# EAGLE schematic boneclamp_rB (EAGLE 6.4)

## Sheet 1 of 6: Beaglebone interface
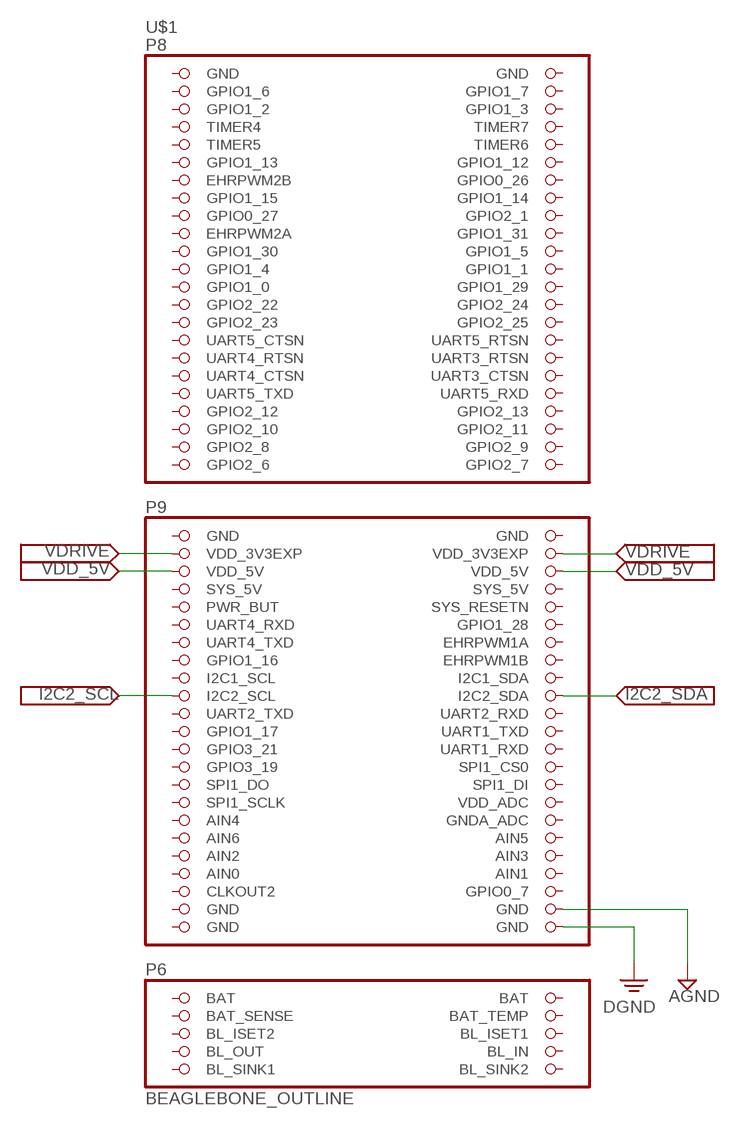
[diagram p0: schematic, sheet 1]

### Parts
U$1  BEAGLEBONE_OUTLINE  [BEAGLEBONE_SHIELD]

### Nets
AGND: U$1.90(GND) ; also sheet 2,3,5,6
DGND: U$1.92(GND) ; also sheet 4,5
I2C2_SCL: U$1.65(I2C2_SCL) ; also sheet 4
I2C2_SDA: U$1.66(I2C2_SDA) ; also sheet 4
VDD_5V: U$1.51(VDD_5V) U$1.52(VDD_5V) ; also sheet 5
VDRIVE: U$1.49(VDD_3V3EXP) U$1.50(VDD_3V3EXP) ; also sheet 2,3,4
Unconnected: U$1.3(GPIO1_6) U$1.4(GPIO1_7) U$1.5(GPIO1_2) U$1.6(GPIO1_3) U$1.7(TIMER4) U$1.8(TIMER7) U$1.9(TIMER5) U$1.10(TIMER6) U$1.11(GPIO1_13) U$1.12(GPIO1_12) U$1.13(EHRPWM2B) U$1.14(GPIO0_26) U$1.15(GPIO1_15) U$1.16(GPIO1_14) U$1.17(GPIO0_27) U$1.18(GPIO2_1) U$1.19(EHRPWM2A) U$1.20(GPIO1_31) U$1.21(GPIO1_30) U$1.22(GPIO1_5) U$1.23(GPIO1_4) U$1.24(GPIO1_1) U$1.25(GPIO1_0) U$1.26(GPIO1_29) U$1.27(GPIO2_22) U$1.28(GPIO2_24) U$1.29(GPIO2_23) U$1.30(GPIO2_25) U$1.31(UART5_CTSN) U$1.32(UART5_RTSN) U$1.33(UART4_RTSN) U$1.34(UART3_RTSN) U$1.35(UART4_CTSN) U$1.36(UART3_CTSN) U$1.37(UART5_TXD) U$1.38(UART5_RXD) U$1.39(GPIO2_12) U$1.40(GPIO2_13) U$1.41(GPIO2_10) U$1.42(GPIO2_11) U$1.43(GPIO2_8) U$1.44(GPIO2_9) U$1.45(GPIO2_6) U$1.46(GPIO2_7) U$1.54(SYS_5V) U$1.55(PWR_BUT) U$1.56(SYS_RESETN) U$1.57(UART4_RXD) U$1.58(GPIO1_28) U$1.59(UART4_TXD) U$1.60(EHRPWM1A) U$1.61(GPIO1_16) U$1.62(EHRPWM1B) U$1.63(I2C1_SCL) U$1.64(I2C1_SDA) U$1.67(UART2_TXD) U$1.68(UART2_RXD) U$1.69(GPIO1_17) U$1.70(UART1_TXD) U$1.71(GPIO3_21) U$1.72(UART1_RXD) U$1.73(GPIO3_19) U$1.74(SPI1_CS0) U$1.75(SPI1_DO) U$1.76(SPI1_DI) U$1.77(SPI1_SCLK) U$1.78(VDD_ADC) U$1.79(AIN4) U$1.80(GNDA_ADC) U$1.81(AIN6) U$1.82(AIN5) U$1.83(AIN2) U$1.84(AIN3) U$1.86(AIN1) U$1.87(CLKOUT2) U$1.88(GPIO0_7) U$1.93(BAT) U$1.94(BAT) U$1.96(BAT_TEMP) U$1.98(BL_ISET1) U$1.99(BL_ISET2)

## Sheet 2 of 6: ADC
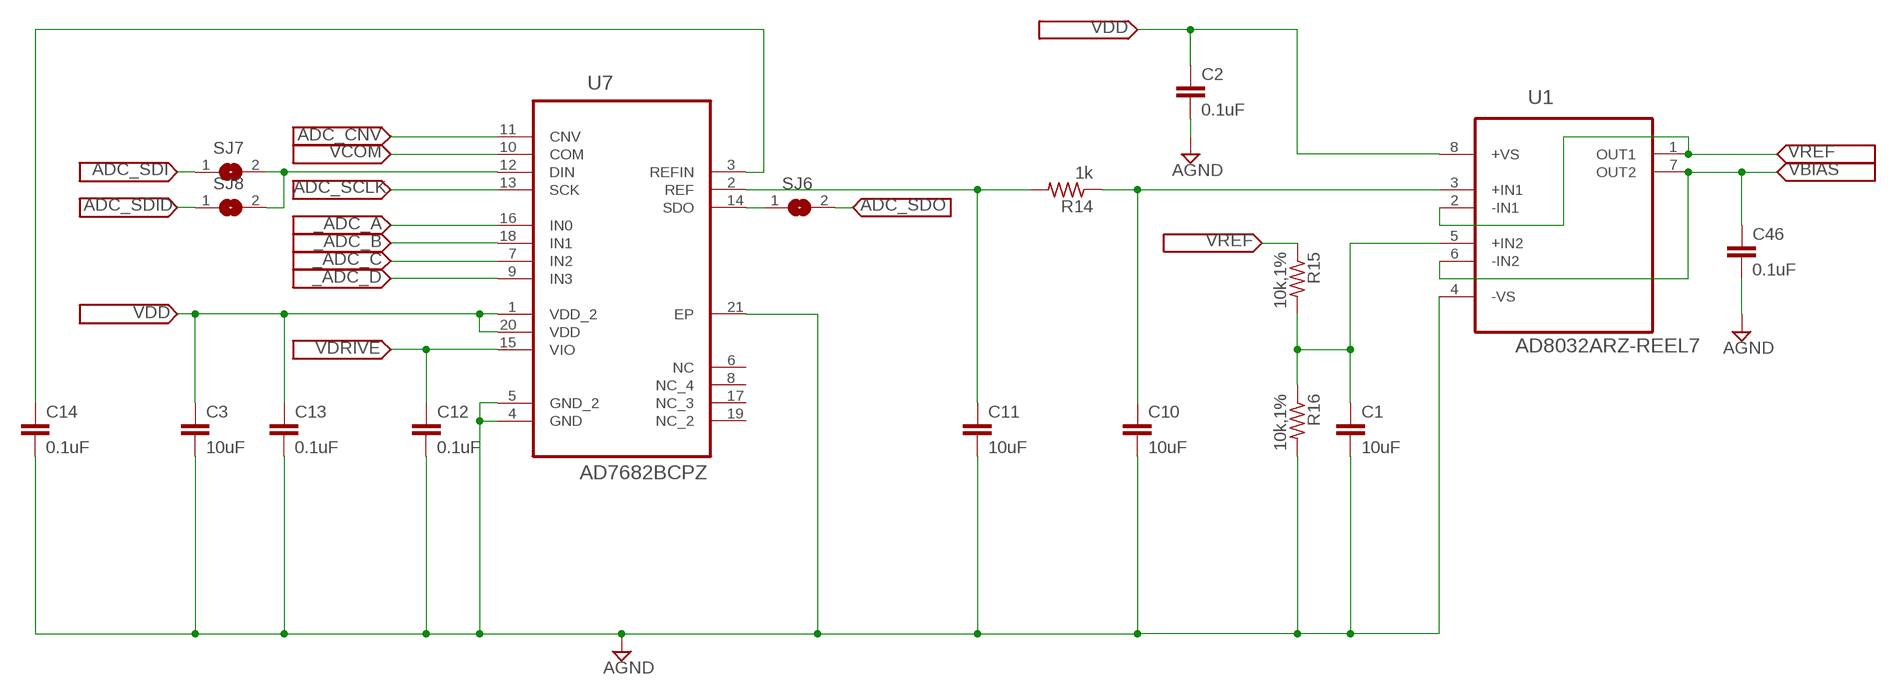
[diagram p1: schematic, sheet 2]

### Parts
C1  10uF  C-EUC0805  [C0805]
C2  0.1uF  C-EUC0805  [C0805]
C3  10uF  C-EUC0805  [C0805]
C10  10uF  C-EUC0805  [C0805]
C11  10uF  C-EUC0805  [C0805]
C12  0.1uF  C-EUC0805  [C0805]
C13  0.1uF  C-EUC0805  [C0805]
C14  0.1uF  C-EUC0805  [C0805]
C46  0.1uF  C-EUC0805  [C0805]
R14  1k  R-US_R0805  [R0805]
R15  10k,1%  R-US_R0805  [R0805]
R16  10k,1%  R-US_R0805  [R0805]
SJ6  SJ  [SJ]
SJ7  SJ  [SJ]
SJ8  SJ  [SJ]
U1  AD8032ARZ-REEL7  [SOIC127P600X175-8N]
U7  AD7682BCPZ  [QFN50P400X400X100-21N]

### Nets
_ADC_A: U7.16(IN0) ; also sheet 6
_ADC_B: U7.18(IN1) ; also sheet 6
_ADC_C: U7.7(IN2) ; also sheet 6
_ADC_D: U7.9(IN3) ; also sheet 6
ADC_CNV: U7.11(CNV)
ADC_SCLK: U7.13(SCK)
ADC_SDI: SJ7.1
ADC_SDID: SJ8.1
ADC_SDO: SJ6.2
AGND: C1.2 C2.2 C3.2 C10.2 C11.2 C12.2 C13.2 C14.2 C46.2 R16.2 U1.4(-VS) U7.4(GND) U7.5(GND_2) U7.21(EP) ; also sheet 1,3,5,6
N$4: C1.1 R15.2 R16.1 U1.5(+IN2)
N$9: SJ6.1
N$11: SJ7.2 SJ8.2 U7.12(DIN)
N$28: C11.1 R14.2 U7.2(REF)
N$29: C10.1 R14.1 U1.3(+IN1)
N$34: C14.1 U7.3(REFIN)
VBIAS: C46.1 U1.6(-IN2) U1.7(OUT2) ; also sheet 6
VCOM: U7.10(COM)
VDD: C2.1 C3.1 C13.1 U1.8(+VS) U7.1(VDD_2) U7.20(VDD) ; also sheet 3,5,6
VDRIVE: C12.1 U7.15(VIO) ; also sheet 1,3,4
VREF: R15.1 U1.1(OUT1) U1.2(-IN1) ; also sheet 3
Unconnected: U7.6(NC) U7.8(NC_4) U7.14(SDO) U7.17(NC_3) U7.19(NC_2)

## Sheet 3 of 6: DAC
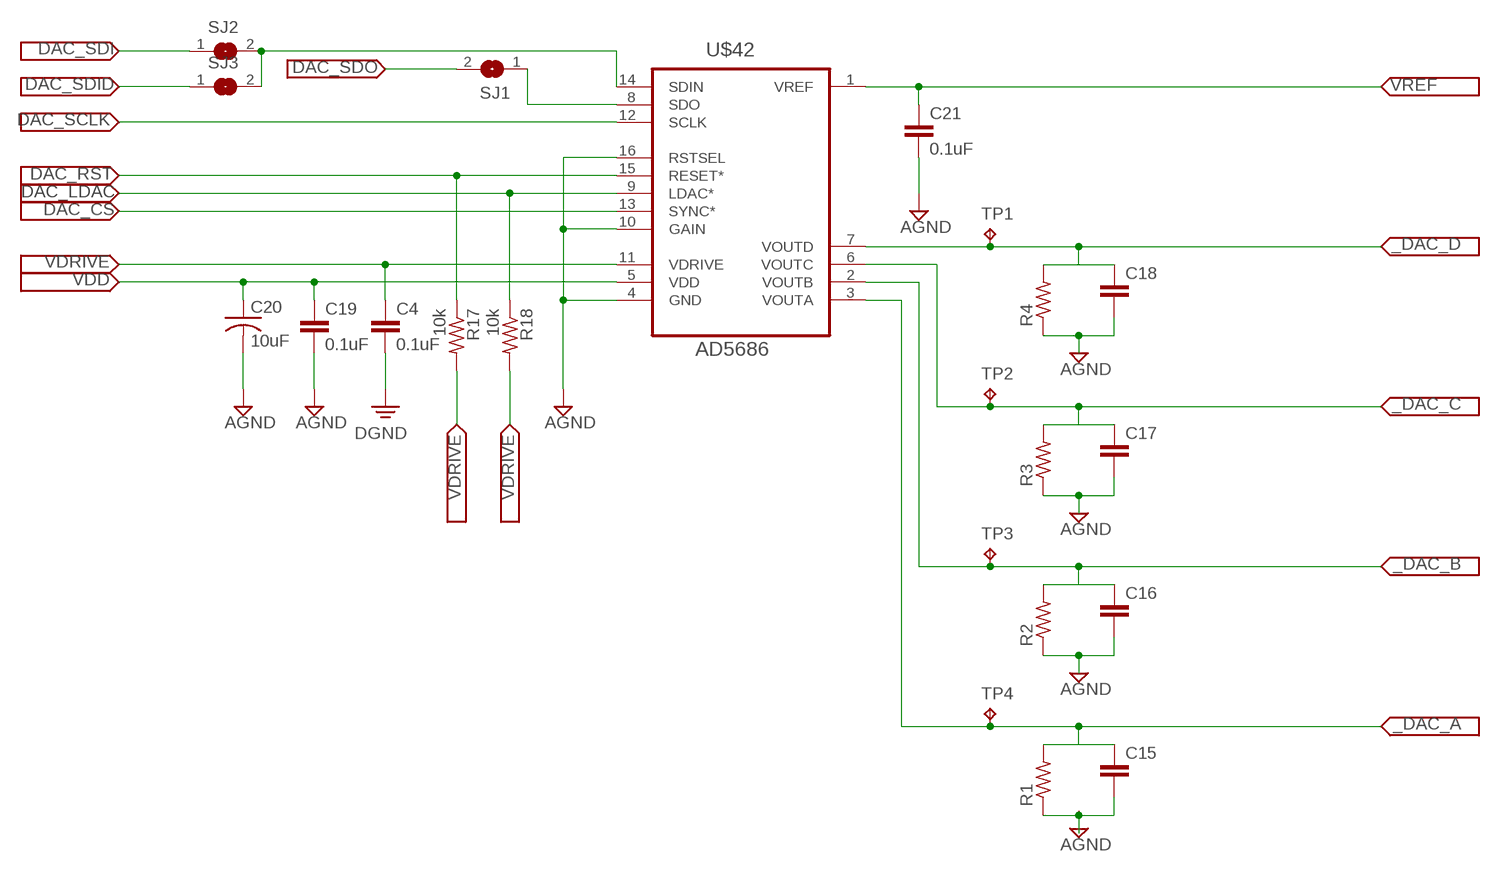
[diagram p2: schematic, sheet 3]

### Parts
C4  0.1uF  C-EUC0805  [C0805]
C15  C-EUC0805  [C0805]
C16  C-EUC0805  [C0805]
C17  C-EUC0805  [C0805]
C18  C-EUC0805  [C0805]
C19  0.1uF  C-EUC0805  [C0805]
C20  10uF  C-USC0805  [C0805]
C21  0.1uF  C-EUC0805  [C0805]
R1  R-US_R0805  [R0805]
R2  R-US_R0805  [R0805]
R3  R-US_R0805  [R0805]
R4  R-US_R0805  [R0805]
R17  10k  R-US_R0805  [R0805]
R18  10k  R-US_R0805  [R0805]
SJ1  SJ  [SJ]
SJ2  SJ  [SJ]
SJ3  SJ  [SJ]
TP1  TPB1,27  [B1,27]
TP2  TPB1,27  [B1,27]
TP3  TPB1,27  [B1,27]
TP4  TPB1,27  [B1,27]
U$42  AD5686  AD5686RARUZ  [MO-153-AB]

### Nets
_DAC_A: C15.1 R1.2 TP4.TP U$42.3(VOUTA) ; also sheet 6
_DAC_B: C16.1 R2.2 TP3.TP U$42.2(VOUTB) ; also sheet 6
_DAC_C: C17.1 R3.2 TP2.TP U$42.6(VOUTC) ; also sheet 6
_DAC_D: C18.1 R4.2 TP1.TP U$42.7(VOUTD) ; also sheet 6
AGND: C16.2 C17.2 C18.2 C19.2 C20.2 C21.2 R2.1 R3.1 R4.1 U$42.4(GND) U$42.10(GAIN) U$42.16(RSTSEL) ; also sheet 1,2,5,6
DAC_CS: U$42.13(SYNC*)
DAC_LDAC: R18.1 U$42.9(LDAC*)
DAC_RST: R17.1 U$42.15(RESET*)
DAC_SCLK: U$42.12(SCLK)
DAC_SDI: SJ2.1
DAC_SDID: SJ3.1
DAC_SDO: SJ1.2
N$7: SJ1.1 U$42.8(SDO)
N$8: SJ2.2 SJ3.2 U$42.14(SDIN)
N$17: C15.2 R1.1
PE: C4.2 ; supply symbol labelled DGND
VDD: C19.1 C20.1 U$42.5(VDD) ; also sheet 2,5,6
VDRIVE: C4.1 R17.2 R18.2 U$42.11(VDRIVE) ; also sheet 1,2,4
VREF: C21.1 U$42.1(VREF) ; also sheet 2

## Sheet 4 of 6: BOARD ID
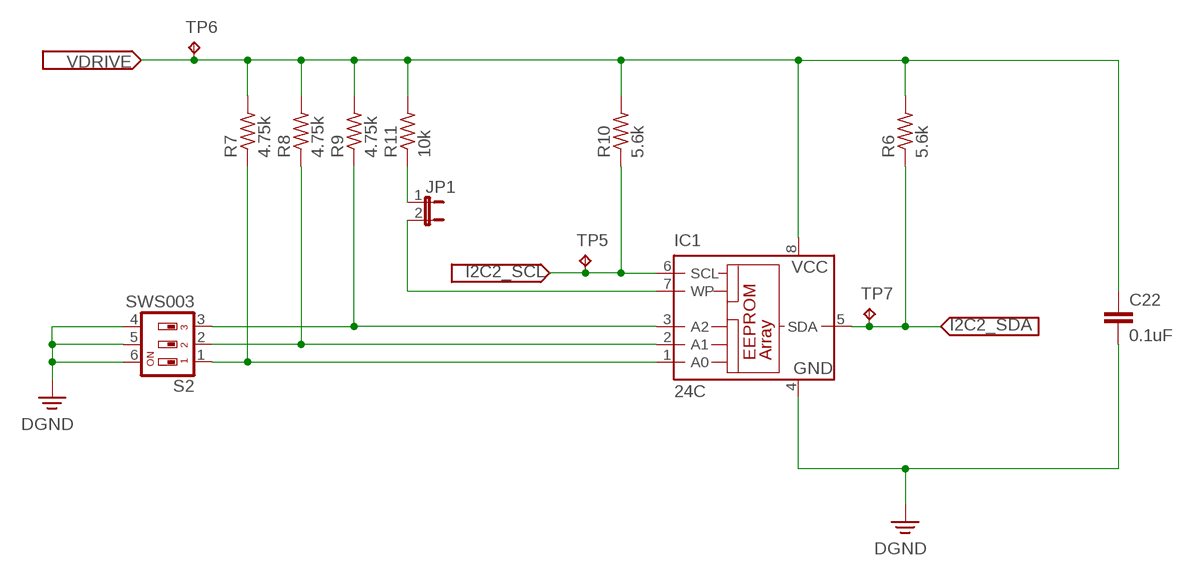
[diagram p3: schematic, sheet 4]

### Parts
C22  0.1uF  C-EUC0603  [C0603]
IC1  24C  [SO-08]
JP1  JP1E  [JP1]
R6  5.6k  R-US_R0603  [R0603]
R7  4.75k  R-US_R0603  [R0603]
R8  4.75k  R-US_R0603  [R0603]
R9  4.75k  R-US_R0603  [R0603]
R10  5.6k  R-US_R0603  [R0603]
R11  10k  R-US_R0603  [R0603]
S2  SWS003  [SMS-003]
TP5  TPB1,27  [B1,27]
TP6  TPB1,27  [B1,27]
TP7  TPB1,27  [B1,27]

### Nets
DGND: C22.2 IC1.4(GND) S2.4 S2.5 S2.6 ; also sheet 1,5
I2C2_SCL: IC1.6(SCL) R10.1 TP5.TP ; also sheet 1
I2C2_SDA: IC1.5(SDA) R6.1 TP7.TP ; also sheet 1
N$14: IC1.1(A0) R7.1 S2.1
N$18: IC1.2(A1) R8.1 S2.2
N$19: IC1.3(A2) R9.1 S2.3
N$21: IC1.7(WP) JP1.2
N$22: JP1.1 R11.1
VDRIVE: C22.1 IC1.8(VCC) R6.2 R7.2 R8.2 R9.2 R10.2 R11.2 TP6.TP ; also sheet 1,2,3

## Sheet 5 of 6: POWER
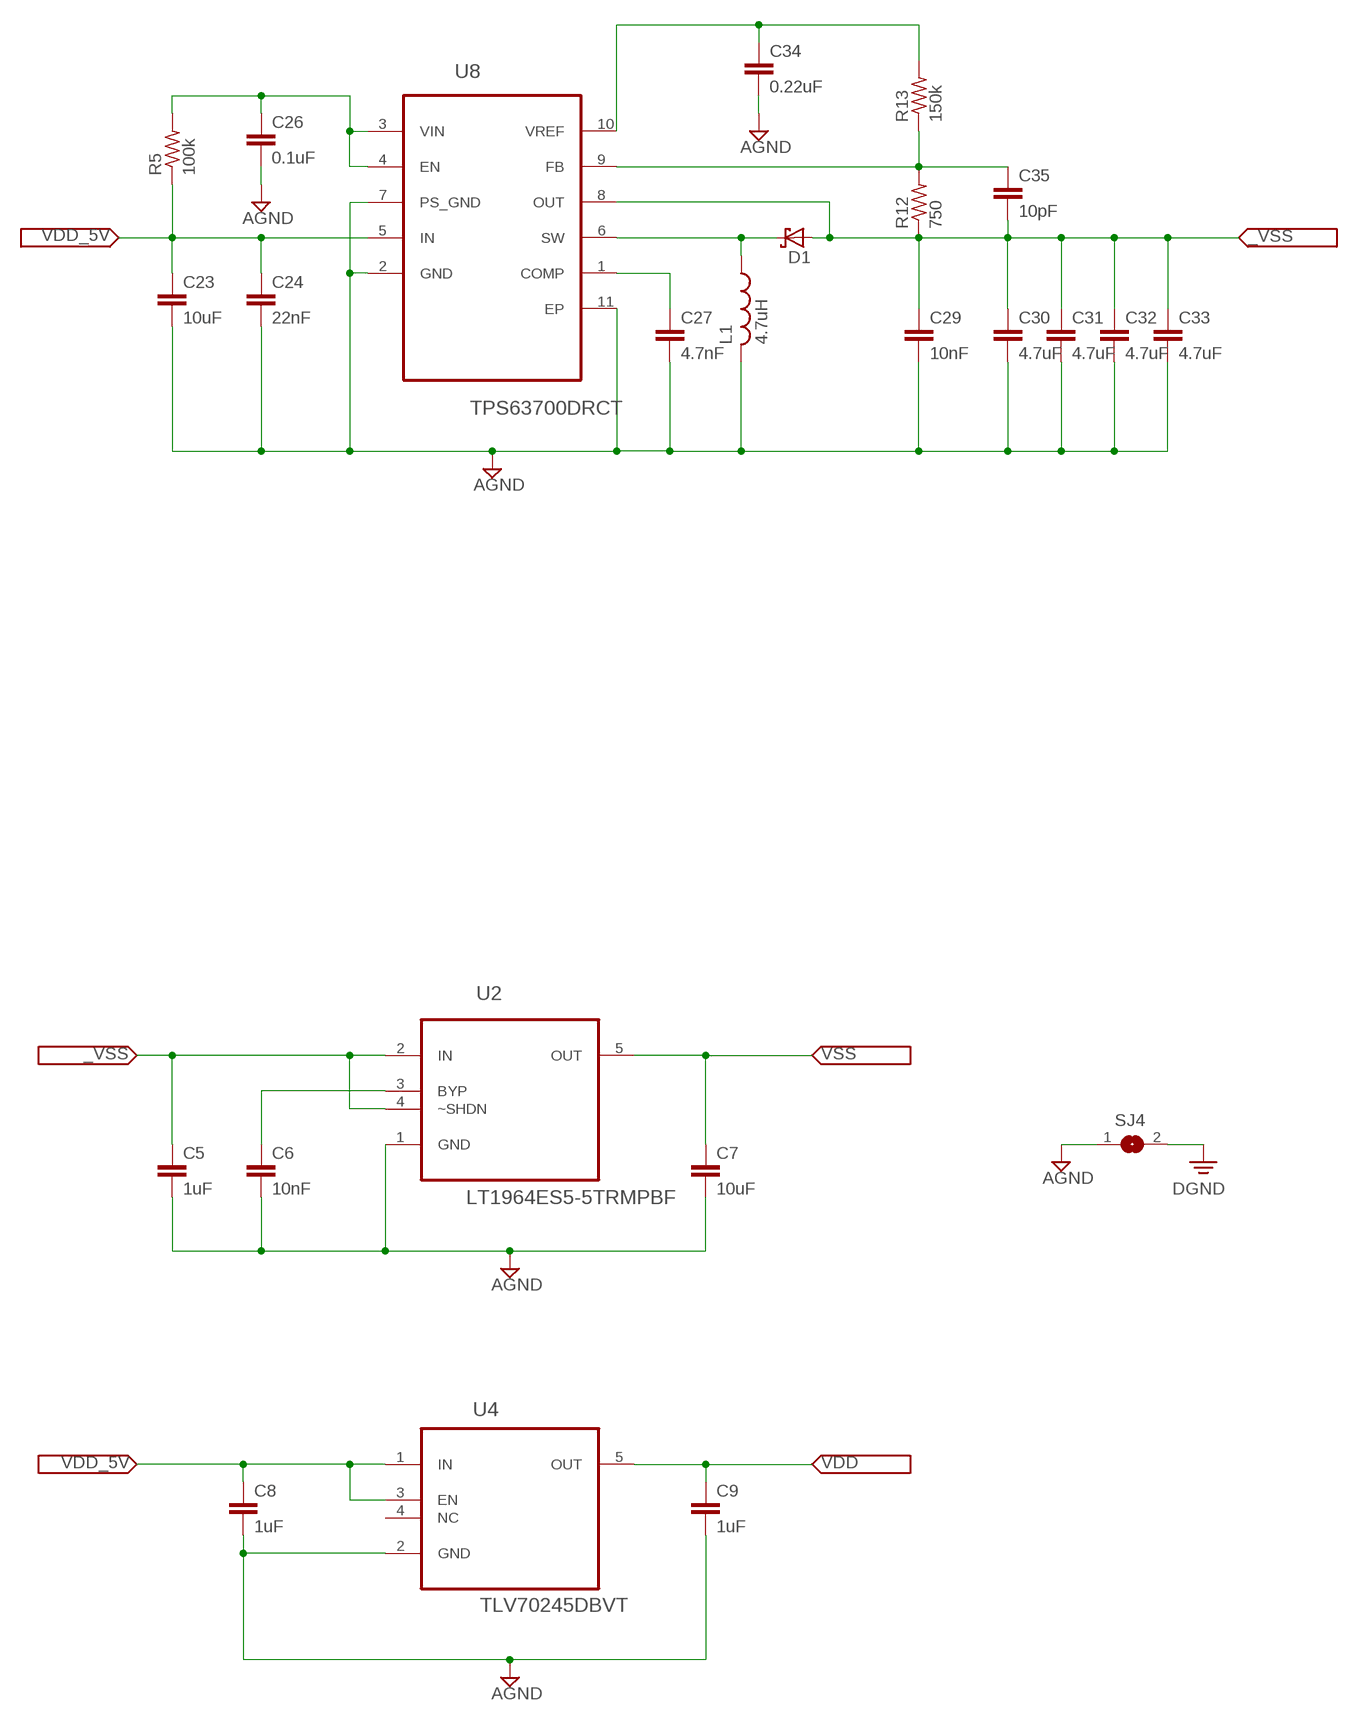
[diagram p4: schematic, sheet 5]

### Parts
C5  1uF  C-EUC0603  [C0603]
C6  10nF  C-EUC0603  [C0603]
C7  10uF  C-EUC0603  [C0603]
C8  1uF  C-EUC0603  [C0603]
C9  1uF  C-EUC0603  [C0603]
C23  10uF  C-EUC0603  [C0603]
C24  22nF  C-EUC0603  [C0603]
C26  0.1uF  C-EUC0603  [C0603]
C27  4.7nF  C-EUC0603  [C0603]
C29  10nF  C-EUC0603  [C0603]
C30  4.7uF  C-EUC0603  [C0603]
C31  4.7uF  C-EUC0603  [C0603]
C32  4.7uF  C-EUC0603  [C0603]
C33  4.7uF  C-EUC0603  [C0603]
C34  0.22uF  C-EUC0603  [C0603]
C35  10pF  C-EUC0603  [C0603]
D1  SCHOTTKY-DIODE-2  [DO-219AB]
L1  4.7uH  L-US  [L4012M]
R5  100k  R-US_R0603  [R0603]
R12  750  R-US_R0603  [R0603]
R13  150k  R-US_R0603  [R0603]
SJ4  SJ  [SJ]
U2  LT1964ES5-5TRMPBF  [SOT95P280X100-5N]
U4  TLV70245DBVT  TLV70025DDCR  [SOT95P280X110-5N]
U8  TPS63700DRCT  [SON50P300X300X100-11N]

### Nets
_VSS: C5.1 C29.1 C30.1 C31.1 C32.1 C33.1 C35.2 D1.P$2(C) R12.1 U2.2(IN) U2.4(~SHDN) U8.8(OUT)
AGND: C5.2 C6.2 C7.2 C8.2 C9.2 C23.2 C24.2 C26.2 C27.2 C29.2 C30.2 C31.2 C32.2 C33.2 C34.2 L1.2 SJ4.1 U2.1(GND) U4.2(GND) U8.2(GND) U8.7(PS_GND) U8.11(EP) ; also sheet 1,2,3,6
DGND: SJ4.2 ; also sheet 1,4
N$16: C6.1 U2.3(BYP)
N$23: C26.1 R5.2 U8.3(VIN) U8.4(EN)
N$25: C27.1 U8.1(COMP)
N$27: D1.P$1(A) L1.1 U8.6(SW)
N$30: C35.1 R12.2 R13.1 U8.9(FB)
N$31: C34.1 R13.2 U8.10(VREF)
VDD: C9.1 U4.5(OUT) ; also sheet 2,3,6
VDD_5V: C8.1 C23.1 C24.1 R5.1 U4.1(IN) U4.3(EN) U8.5(IN) ; also sheet 1
VSS: C7.1 U2.5(OUT) ; also sheet 6
Unconnected: U4.4(NC)

## Sheet 6 of 6: I/O HEADER
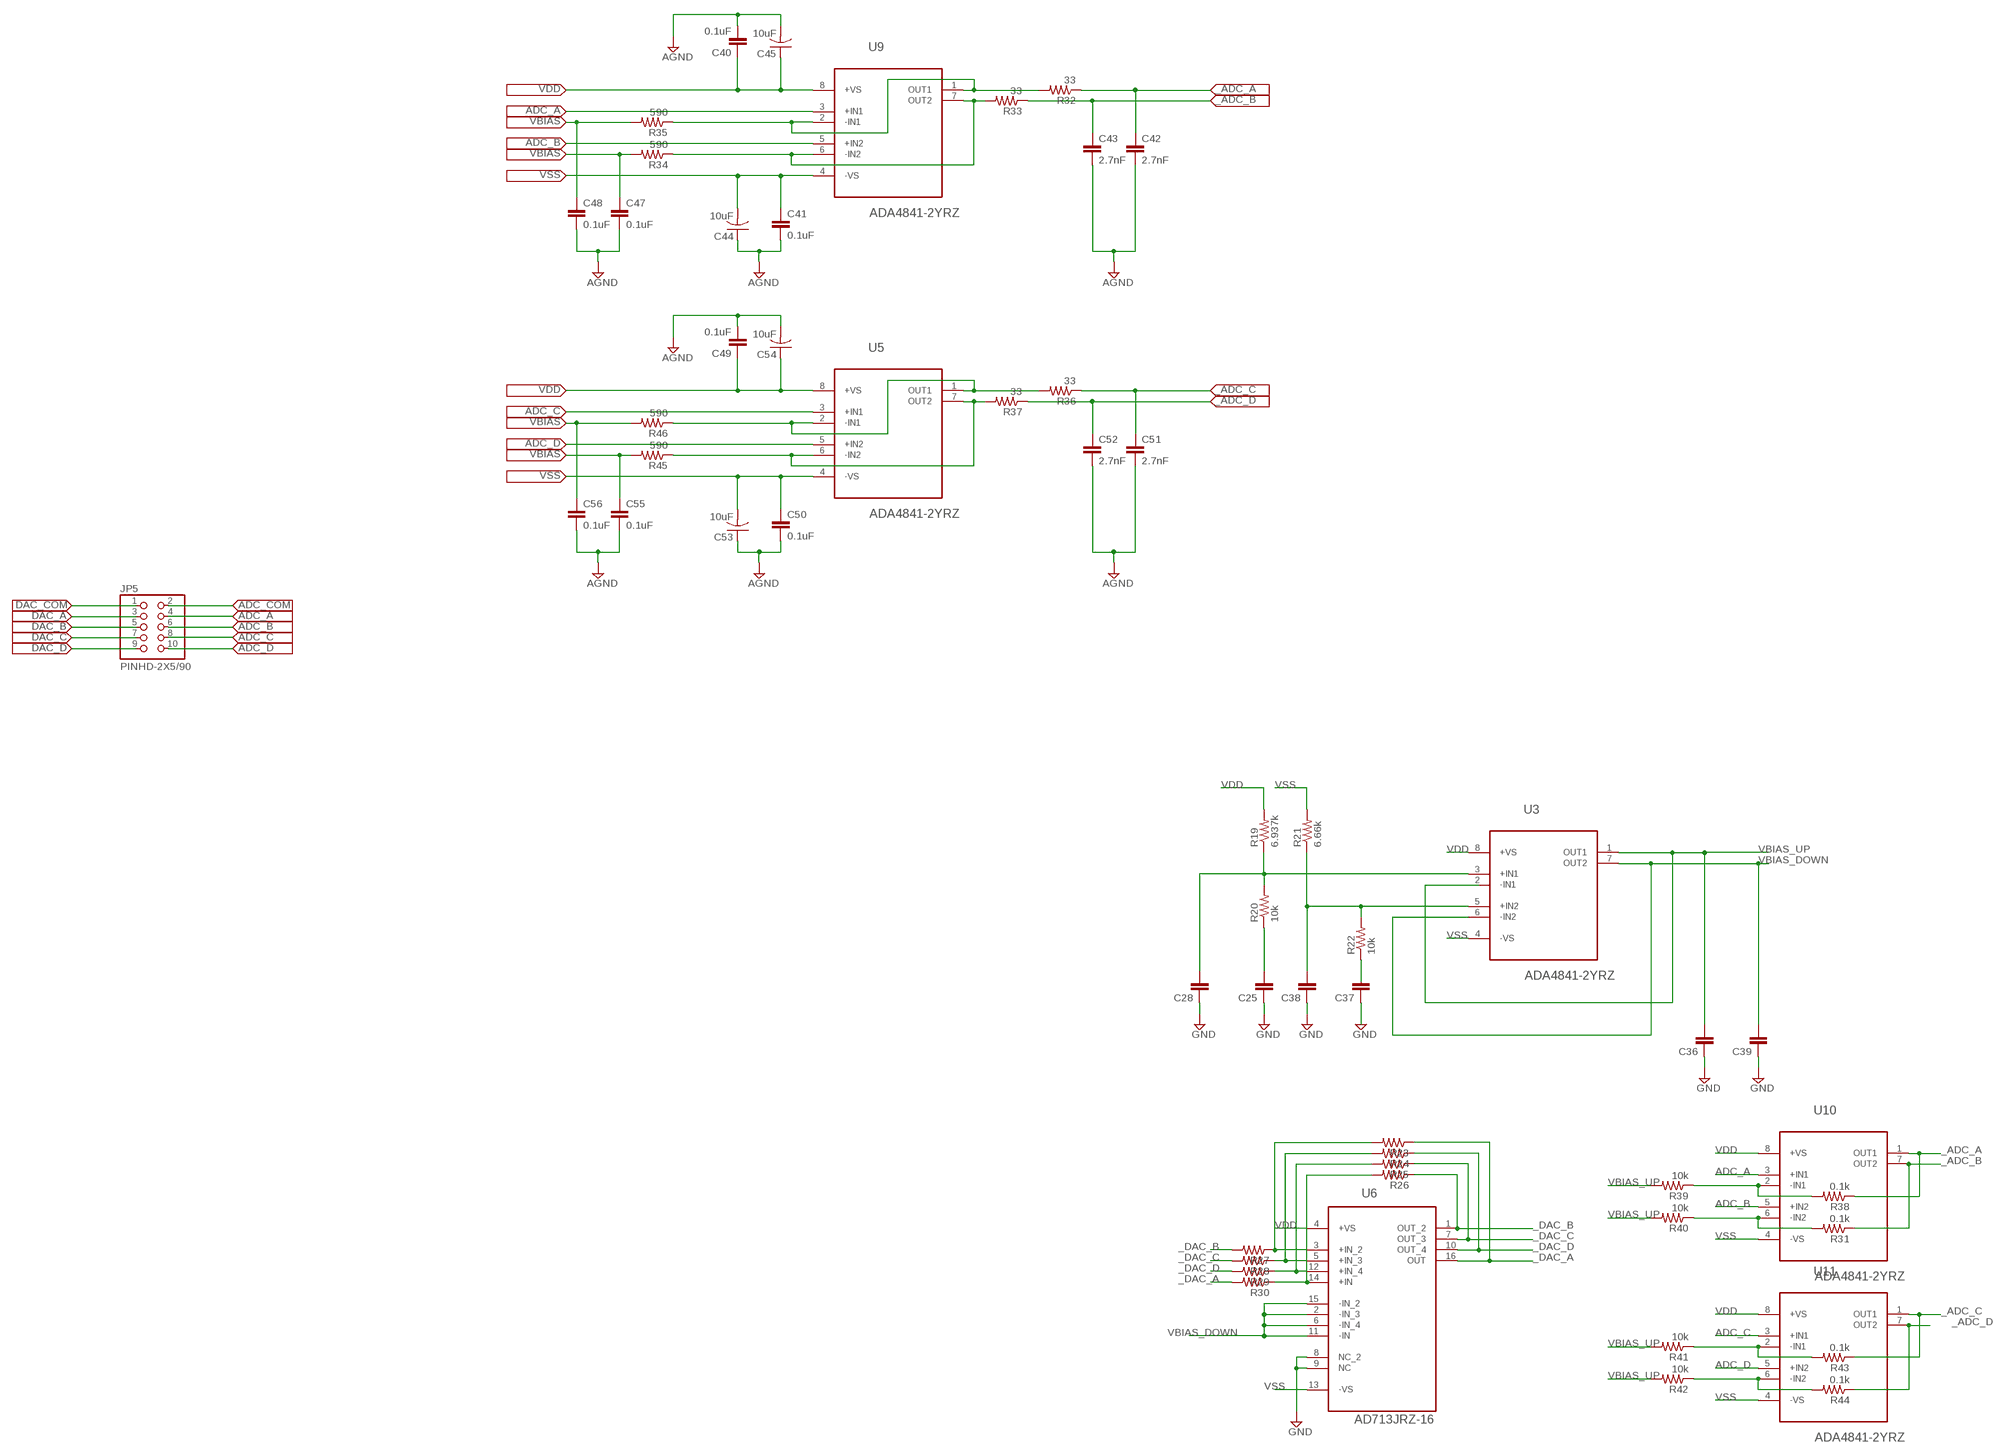
[diagram p5: schematic, sheet 6]

### Parts
C25  C-EU025-025X050  [C025-025X050]
C28  C-EU025-025X050  [C025-025X050]
C36  C-EU025-025X050  [C025-025X050]
C37  C-EU025-025X050  [C025-025X050]
C38  C-EU025-025X050  [C025-025X050]
C39  C-EU025-025X050  [C025-025X050]
C40  0.1uF  C-EUC0805  [C0805]
C41  0.1uF  C-EUC0805  [C0805]
C42  2.7nF  C-EUC0805  [C0805]
C43  2.7nF  C-EUC0805  [C0805]
C44  10uF  C-USC0805  [C0805]
C45  10uF  C-USC0805  [C0805]
C47  0.1uF  C-EUC0805  [C0805]
C48  0.1uF  C-EUC0805  [C0805]
C49  0.1uF  C-EUC0805  [C0805]
C50  0.1uF  C-EUC0805  [C0805]
C51  2.7nF  C-EUC0805  [C0805]
C52  2.7nF  C-EUC0805  [C0805]
C53  10uF  C-USC0805  [C0805]
C54  10uF  C-USC0805  [C0805]
C55  0.1uF  C-EUC0805  [C0805]
C56  0.1uF  C-EUC0805  [C0805]
JP5  PINHD-2X5/90  [2X05/90]
R19  6.937k  R-US_0204/2V  [0204V]
R20  10k  R-US_0204/2V  [0204V]
R21  6.66k  R-US_0204/2V  [0204V]
R22  10k  R-US_0204/2V  [0204V]
R23  R-US_0204/2V  [0204V]
R24  R-US_0204/2V  [0204V]
R25  R-US_0204/2V  [0204V]
R26  R-US_0204/2V  [0204V]
R27  R-US_0204/2V  [0204V]
R28  R-US_0204/2V  [0204V]
R29  R-US_0204/2V  [0204V]
R30  R-US_0204/2V  [0204V]
R31  0.1k  R-US_R0805  [R0805]
R32  33  R-US_R0603  [R0603]
R33  33  R-US_R0603  [R0603]
R34  590  R-US_R0603  [R0603]
R35  590  R-US_R0603  [R0603]
R36  33  R-US_R0603  [R0603]
R37  33  R-US_R0603  [R0603]
R38  0.1k  R-US_R0805  [R0805]
R39  10k  R-US_R0805  [R0805]
R40  10k  R-US_R0805  [R0805]
R41  10k  R-US_R0805  [R0805]
R42  10k  R-US_R0805  [R0805]
R43  0.1k  R-US_R0805  [R0805]
R44  0.1k  R-US_R0805  [R0805]
R45  590  R-US_R0603  [R0603]
R46  590  R-US_R0603  [R0603]
U3  ADA4841-2YRZ  [SOIC127P600X175-8N]
U5  ADA4841-2YRZ  [SOIC127P600X175-8N]
U6  AD713JRZ-16  [SOIC127P1032X265-16N]
U9  ADA4841-2YRZ  [SOIC127P600X175-8N]
U10  ADA4841-2YRZ  [SOIC127P600X175-8N]
U11  ADA4841-2YRZ  [SOIC127P600X175-8N]

### Nets
_ADC_A: C42.1 R32.1 R38.1 U10.1(OUT1) ; also sheet 2
_ADC_B: C43.1 R31.1 R33.1 U10.7(OUT2) ; also sheet 2
_ADC_C: C51.1 R36.1 R43.1 U11.1(OUT1) ; also sheet 2
_ADC_D: C52.1 R37.1 R44.1 U11.7(OUT2) ; also sheet 2
_DAC_A: R23.1 R30.2 U6.16(OUT) ; also sheet 3
_DAC_B: R26.1 R27.2 U6.1(OUT_2) ; also sheet 3
_DAC_C: R25.1 R28.2 U6.7(OUT_3) ; also sheet 3
_DAC_D: R24.1 R29.2 U6.10(OUT_4) ; also sheet 3
ADC_A: JP5.4 U9.3(+IN1) U10.3(+IN1)
ADC_B: JP5.6 U9.5(+IN2) U10.5(+IN2)
ADC_C: JP5.8 U5.3(+IN1) U11.3(+IN1)
ADC_COM: JP5.2
ADC_D: JP5.10 U5.5(+IN2) U11.5(+IN2)
AGND: C40.2 C41.2 C42.2 C43.2 C44.1 C45.2 C47.2 C48.2 C49.2 C50.2 C51.2 C52.2 C53.1 C54.2 C55.2 C56.2 ; also sheet 1,2,3,5
DAC_A: JP5.3
DAC_B: JP5.5
DAC_C: JP5.7
DAC_COM: JP5.1
DAC_D: JP5.9
GND: C25.1 C28.1 C36.1 C38.1 C39.1 U6.8(NC_2) U6.9(NC)
N$1: R37.2 R45.1 U5.6(-IN2) U5.7(OUT2)
N$2: R33.2 R34.1 U9.6(-IN2) U9.7(OUT2)
N$3: R26.2 R30.1 U6.14(+IN)
N$5: R36.2 R46.1 U5.1(OUT1) U5.2(-IN1)
N$20: R32.2 R35.1 U9.1(OUT1) U9.2(-IN1)
N$52: R25.2 R29.1 U6.12(+IN_4)
N$53: C38.2 R21.1 R22.2 U3.5(+IN2)
N$54: C28.2 R19.1 R20.2 U3.3(+IN1)
N$55: R24.2 R28.1 U6.5(+IN_3)
N$56: R23.2 R27.1 U6.3(+IN_2)
N$57: C25.2 R20.1
N$58: C37.1
N$59: R22.1
VBIAS: C47.1 C48.1 C55.1 C56.1 R34.2 R35.2 R45.2 R46.2 ; also sheet 2
VBIAS_DOWN: C39.2 U3.6(-IN2) U3.7(OUT2) U6.2(-IN_3) U6.6(-IN_4) U6.11(-IN) U6.15(-IN_2)
VBIAS_UP: C36.2 R31.2 R38.2 R39.1 R39.2 R40.1 R40.2 R41.1 R41.2 R42.1 R42.2 R43.2 R44.2 U3.1(OUT1) U3.2(-IN1) U10.2(-IN1) U10.6(-IN2) U11.2(-IN1) U11.6(-IN2)
VDD: C40.1 C45.1 C49.1 C54.1 R19.2 U3.8(+VS) U5.8(+VS) U6.4(+VS) U9.8(+VS) U10.8(+VS) U11.8(+VS) ; also sheet 2,3,5
VSS: C41.1 C44.2 C50.1 C53.2 R21.2 U3.4(-VS) U5.4(-VS) U6.13(-VS) U9.4(-VS) U10.4(-VS) U11.4(-VS) ; also sheet 5
Unconnected: C37.2

## Power pins joined to a net without a drawn wire
AIN0: U$1.85(AIN0)
BAT_SENSE: U$1.95(BAT_SENSE)
BL_IN: U$1.97(BL_IN)
BL_OUT: U$1.100(BL_OUT)
BL_SINK1: U$1.101(BL_SINK1)
BL_SINK2: U$1.102(BL_SINK2)
GND: U$1.1(GND) U$1.2(GND) U$1.47(GND) U$1.48(GND) U$1.89(GND) U$1.91(GND)
SYS_5V: U$1.53(SYS_5V)

## Library data of the parts
C1-C19 C21-C24 C26 C27 C29-C35 C40-C43 C46-C52 C55 C56 = rcl:C-EU: CAPACITOR, European symbol
C20 C44 C45 C53 C54 = rcl:C-US: CAPACITOR, American symbol
C25 C28 C36-C39 = resistor:C-EU: CAPACITOR, European symbol
D1 = boneclamp:SCHOTTKY-DIODE-2
IC1 = on-semiconductor-01:24C*: Serial EEPROM 1 K/2 K/4 K
JP1 = jumper:JP1E: JUMPER
JP5 = adafruit:PINHD-2X5
L1 = boneclamp:L-US
R1-R13 R17 R18 R31-R46 = rcl:R-US_: RESISTOR, American symbol
R14-R16 R19-R30 = resistor:R-US_: RESISTOR, American symbol
S2 = smd-special:SWS003: SMD Dip Switch 3 pol.
SJ1-SJ4 SJ6-SJ8 = jumper:SJ: SMD solder JUMPER
TP1-TP7 = testpad:TP: Test pad
U1 = analog-devices-02:AD8032ARZ-REEL7: Rail-to-Rail I/O Amplifiers; MPN: AD8032ARZ-REEL7; OC_FARNELL: unknown; OC_NEWARK: 82H2954; PACKAGE: SOIC-8; SUPPLIER: Analog Devices
U2 = linear-extended-01:LT1964ES5-5TRMPBF: Low Dropout Negative Micropower Regulator; MPN: LT1964ES5-5#TRMPBF; OC_FARNELL: 1663814; OC_NEWARK: 59M8319; PACKAGE: TSOT-23-5; SUPPLIER: Linear Technology
U3 U5 U9-U11 = analog-devices-01:ADA4841-2YRZ: Low Power, Low Noise and Distortion,Rail-to-Rail Output Amplifiers; MPN: ADA4841-2YRZ; OC_FARNELL: 1274192; OC_NEWARK: 19M0648; PACKAGE: SOIC-8; SUPPLIER: Analog Devices
U4 = ti-extended:TLV70025DDCR: 200-mA, Low-IQ, Low-Dropout Regulator for Portable Devices; MPN: TLV70025DDCR; OC_FARNELL: -; OC_NEWARK: 64R0678; PACKAGE: TSOT-23-5; SUPPLIER: Texas Instruments
U6 = analog-devices-01:AD713JRZ-16: Quad Precision, Low Cost, High Speed, BiFET Op Amp; MPN: AD713JRZ-16; OC_FARNELL: 1660969; OC_NEWARK: 59K4560; PACKAGE: SOIC-16; SUPPLIER: Analog Devices
U7 = analog-devices-02:AD7682BCPZ: 16-Bit, 4-Channel/8-Channel,250 kSPS DAC; MPN: AD7682BCPZ; OC_FARNELL: 2067751; OC_NEWARK: 14N5814; PACKAGE: 20-LFCSP; SUPPLIER: Analog Devices
U8 = ti-extended:TPS63700DRCT: DC-DC INVERTER; MPN: TPS63700DRCT; OC_FARNELL: 1605461; OC_NEWARK: 61K1899; PACKAGE: SON-10; SUPPLIER: TEXAS INSTRUMENTS
U$1 = adafruit:BEAGLEBONE_OUTLINE: Should match A3 pinout - but not completely tested
U$42 = analog-devices-02:AD5686RARUZ